# Altium schematic sheet Nuio_Left_Keyboard_Rev_H_MCU.SchDoc: Nuio - Left Keyboard MCU
size B; SheetNumber: 2; SheetTotal: 5; PageSetup: Record=PageOptions|CenterHorizontal=True|CenterVertical=True|PrintScale=0.95|XCorrection=1.00|YCorrection=1.00|PrintKind=1|BorderSize=5000000|LeftOffset=0|BottomOffset=0|Orientation=2|PaperLength=1000|PaperWidth=1000|Scale=100|PaperSource=7|PrintQuality=-4|MediaType=1|DitherType=10|PaperKind=Letter|PrintScaleMode=1
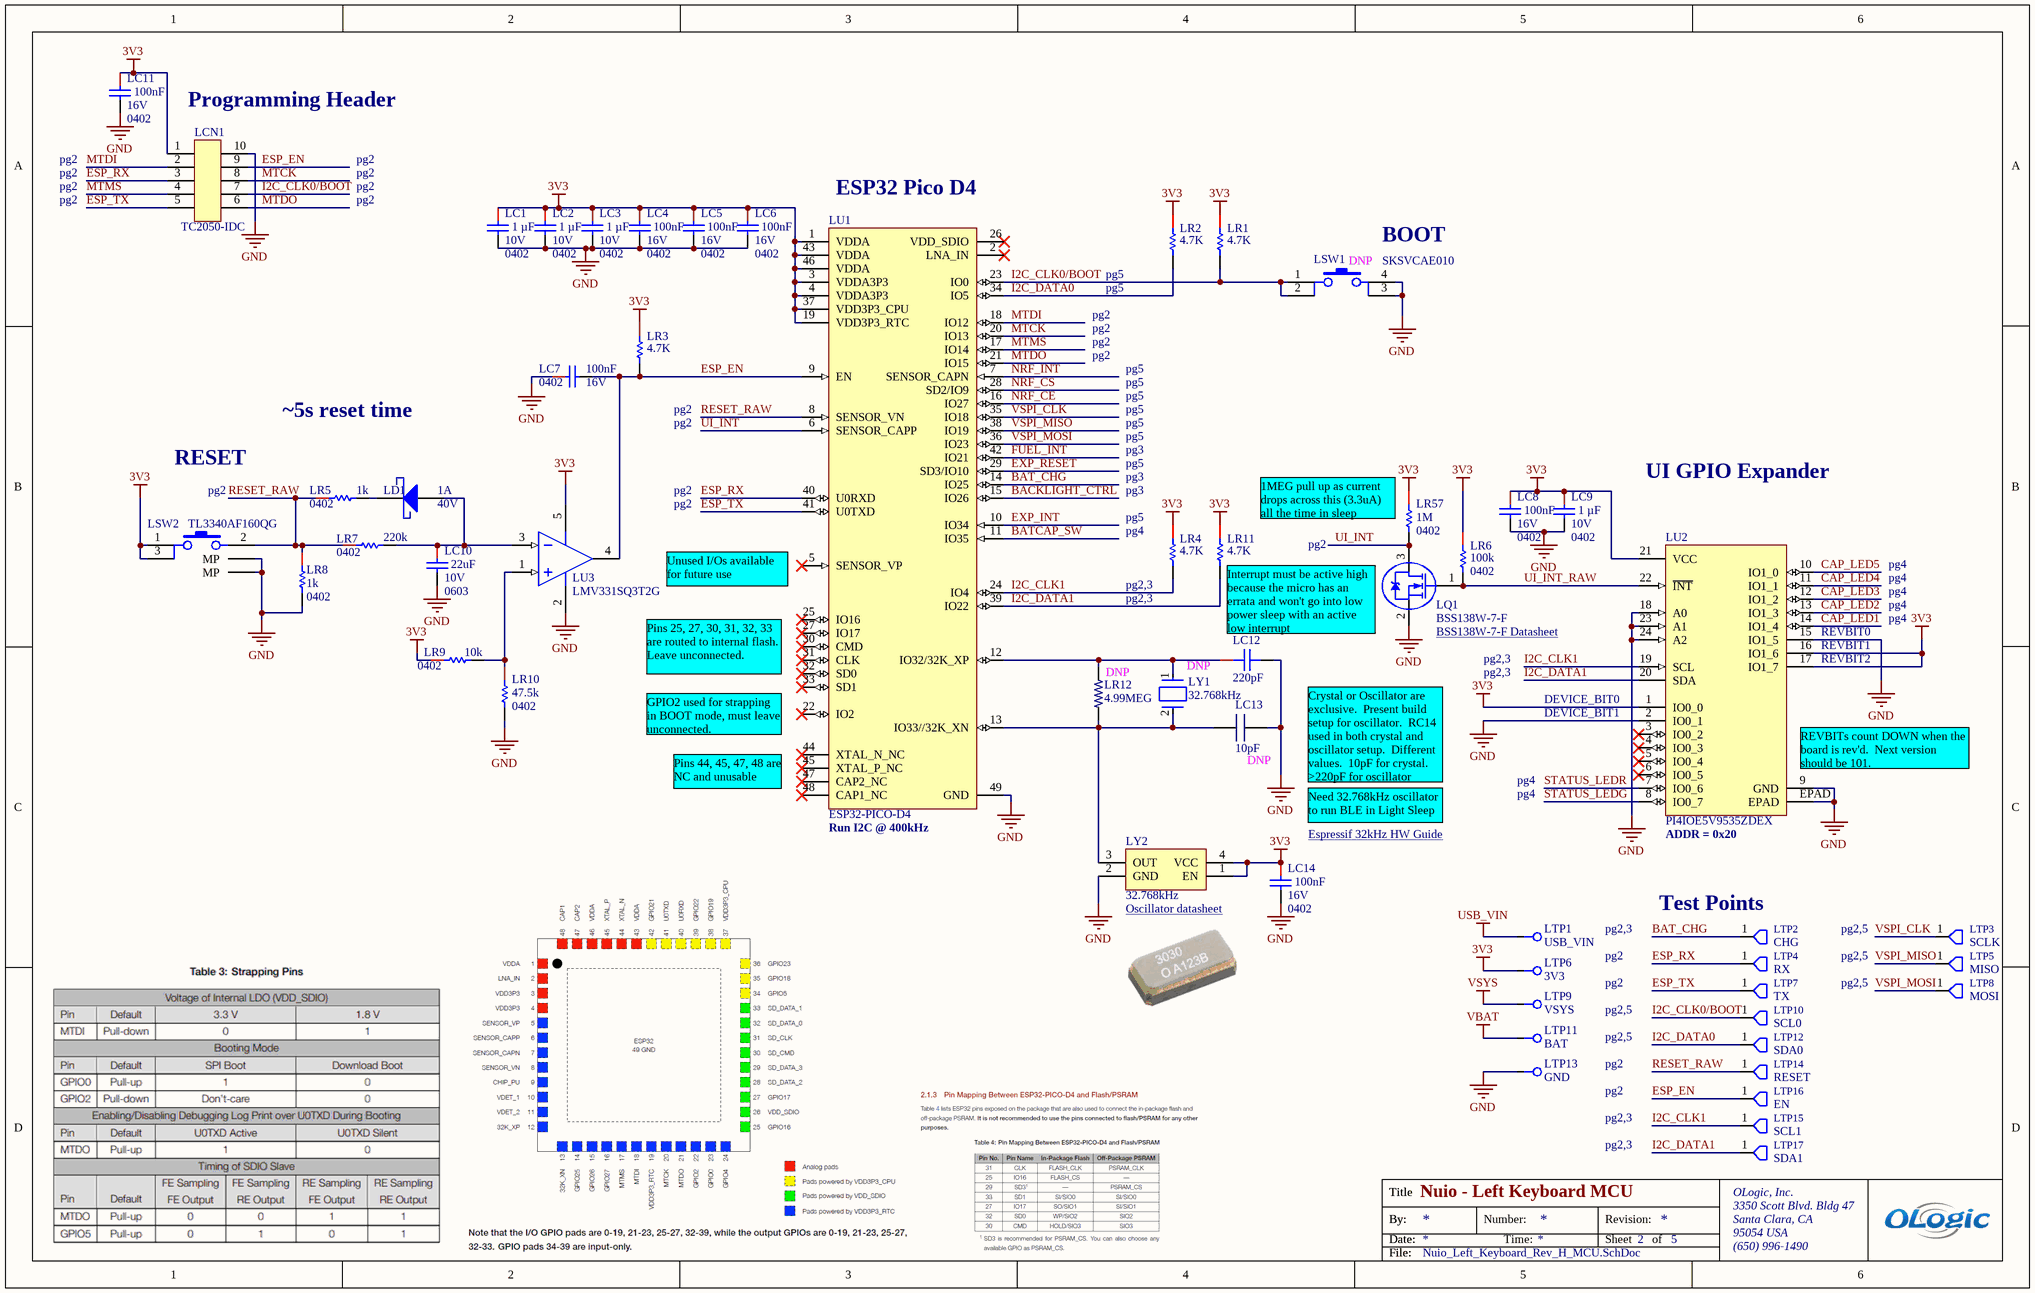
[diagram p0: Nuio_Left_Keyboard_Rev_H_MCU.SchDoc]

## Parts
LC1  Package (Imperial): 0402  Voltage (Rated): 10V  Capacitance: 1 µF  [CAPC0402(1005)_L]  (hidden comment: CAP CER 1UF 10V X5R 0402)
LC2  Package (Imperial): 0402  Voltage (Rated): 10V  Capacitance: 1 µF  [CAPC0402(1005)_L]  (hidden comment: CAP CER 1UF 10V X5R 0402)
LC3  Package (Imperial): 0402  Voltage (Rated): 10V  Capacitance: 1 µF  [CAPC0402(1005)_L]  (hidden comment: CAP CER 1UF 10V X5R 0402)
LC4  Package (Imperial): 0402  Voltage (Rated): 16V  Capacitance: 100nF  [CAPC0402(1005)_L]  (hidden comment: CAP CER 0.1UF 16V X5R 0402)
LC5  Package (Imperial): 0402  Voltage (Rated): 16V  Capacitance: 100nF  [CAPC0402(1005)_L]  (hidden comment: CAP CER 0.1UF 16V X5R 0402)
LC6  Package (Imperial): 0402  Voltage (Rated): 16V  Capacitance: 100nF  [CAPC0402(1005)_L]  (hidden comment: CAP CER 0.1UF 16V X5R 0402)
LC7  Package (Imperial): 0402  Voltage (Rated): 16V  Capacitance: 100nF  [CAPC0402(1005)_L]  (hidden comment: CAP CER 0.1UF 16V X5R 0402)
LC8  Package (Imperial): 0402  Voltage (Rated): 16V  Capacitance: 100nF  [CAPC0402(1005)_L]  (hidden comment: CAP CER 0.1UF 16V X5R 0402)
LC9  Package (Imperial): 0402  Voltage (Rated): 10V  Capacitance: 1 µF  [CAPC0402(1005)_L]  (hidden comment: CAP CER 1UF 10V X5R 0402)
LC10  22uF  Voltage Rating (DC): 10V  Case Code (Imperial): 0603  [CAPC0603(1608)_L]
LC11  Package (Imperial): 0402  Voltage (Rated): 16V  Capacitance: 100nF  [CAPC0402(1005)_L]  (hidden comment: CAP CER 0.1UF 16V X5R 0402)
LC12  220pF  [CAPC0402(1005)_L]
LC13  10pF  [CAPC0402(1005)_L]  (no BOM)
LC14  Package (Imperial): 0402  Voltage (Rated): 16V  Capacitance: 100nF  [CAPC0402(1005)_L]  (hidden comment: CAP CER 0.1UF 16V X5R 0402)
LCN1  TC2050-IDC  [TC2050-IDC]  (no BOM)
LD1  DC Reverse Voltage Max: 40V  Current Avg Rectified: 1A  [PMEG4010AESBYL-Footprint-1]  (hidden comment: PMEG4010AESBYL)
LQ1  BSS138W-7-F  [DIOD-SOT323-3_V]
LR1  4.7K  [RESC0402(1005)_L]
LR2  4.7K  [RESC0402(1005)_L]
LR3  4.7K  [RESC0402(1005)_L]
LR4  4.7K  [RESC0402(1005)_L]
LR5  Resistance: 1k  Package (Imperial): 0402  [RESC0402(1005)_L]  (hidden comment: RES SMD 1K OHM 1% 1/16W 0402)
LR6  value 100k  Case Code (Imperial): 0402  [RESC0402(1005)_L]  (hidden comment: RES 100K OHM 1% 1/16W 0402)
LR7  Package (Imperial): 0402  [RESC0402(1005)_L]  (hidden comment: 220K)
LR8  Resistance: 1k  Package (Imperial): 0402  [RESC0402(1005)_L]  (hidden comment: RES SMD 1K OHM 1% 1/16W 0402)
LR9  Resistance: 10k  Package (Imperial): 0402  [RESC0402_YAGEO]  (hidden comment: RES SMD 10K OHM 1% 1/16W 0402)
LR10  Resistance: 47.5k  Package (Imperial): 0402  [RESC0402(1005)_L]  (hidden comment: RES 47.5K OHM 1% 1/16W 0402)
LR11  4.7K  [RESC0402(1005)_L]
LR12  4.99MEG  [RESC0402(1005)_L]  (no BOM)
LR57  Resistance: 1M  Case/Package: 0402  [RESC0402(1005)_L]  (hidden comment: RES 1M OHM 1% 1/16W 0402)
LSW1  SKSVCAE010  [SKSVCAE010]  (no BOM)
LSW2  TL3340AF160QG  [TL3340AF160QG]
LTP1  USB_VIN  [Pogo-Testpoint]  (no BOM)
LTP2  CHG  [MTK-TESTPOINT-20]  (no BOM)
LTP3  SCLK  [MTK-TESTPOINT-20]  (no BOM)
LTP4  RX  [MTK-TESTPOINT-20]  (no BOM)
LTP5  MISO  [MTK-TESTPOINT-20]  (no BOM)
LTP6  3V3  [Pogo-Testpoint]  (no BOM)
LTP7  TX  [MTK-TESTPOINT-20]  (no BOM)
LTP8  MOSI  [MTK-TESTPOINT-20]  (no BOM)
LTP9  VSYS  [Pogo-Testpoint]  (no BOM)
LTP10  SCL0  [MTK-TESTPOINT-20]  (no BOM)
LTP11  BAT  [Pogo-Testpoint]  (no BOM)
LTP12  SDA0  [MTK-TESTPOINT-20]  (no BOM)
LTP13  GND  [Pogo-Testpoint]  (no BOM)
LTP14  RESET  [MTK-TESTPOINT-20]  (no BOM)
LTP15  SCL1  [MTK-TESTPOINT-20]  (no BOM)
LTP16  EN  [MTK-TESTPOINT-20]  (no BOM)
LTP17  SDA1  [MTK-TESTPOINT-20]  (no BOM)
LU1  ESP32-PICO-D4  [ESP32-PICO-D4]
LU2  PI4IOE5V9535ZDEX  [PI4IOE5V9535ZDEX]
LU3  LMV331SQ3T2G  [ONSC-SC70-5-419A-02_K_L]
LY1  32.768kHz  [FP-9HT10-MFG]  (no BOM)
LY2  32.768kHz  [ESPSON SG-3031CM]

## Nets
3V3: LC1.1 LC2.1 LC3.1 LC4.1 LC5.1 LC6.1 LC8.1 LC9.1 LC11.1 LC14.1 LCN1.1 LR1.1 LR2.1 LR3.1 LR4.1 LR6.1 LR9.1 LR11.1 LR57.1 LSW2.1 LSW2.3 LTP6.1 LU1.1(VDDA) LU1.3(VDDA3P3) LU1.4(VDDA3P3) LU1.19(VDD3P3_RTC) LU1.37(VDD3P3_CPU) LU1.43(VDDA) LU1.46(VDDA) LU2.1(IO0_0) LU2.16(IO1_6) LU2.17(IO1_7) LU2.21(VCC) LU3.5(VCC) LY2.1(EN) LY2.4(VCC)
GND: LC1.2 LC2.2 LC3.2 LC4.2 LC5.2 LC6.2 LC7.1 LC8.2 LC9.2 LC10.2 LC11.2 LC12.2 LC13.2 LC14.2 LCN1.10 LQ1.2(S) LR8.2 LR10.2 LSW1.3 LSW1.4 LSW2.MP1(MP) LSW2.MP2(MP) LTP13.1 LU1.49(GND) LU2.2(IO0_1) LU2.9(GND) LU2.15(IO1_5) LU2.18(A0) LU2.23(A1) LU2.24(A2) LU2.EPAD LU3.2(GND) LY2.2(GND)
USB_VIN: LTP1.1
VBAT: LTP11.1
VSYS: LTP9.1
BACKLIGHT_CTRL: LU1.15(IO26)
BAT_CHG: LTP2.1(TP) LU1.14(IO25)
BATCAP_SW: LU1.11(IO35)
CAP_LED1: LU2.14(IO1_4)
CAP_LED2: LU2.13(IO1_3)
CAP_LED3: LU2.12(IO1_2)
CAP_LED4: LU2.11(IO1_1)
CAP_LED5: LU2.10(IO1_0)
ESP_EN: LC7.2 LCN1.9 LR3.2 LTP16.1(TP) LU1.9(EN) LU3.4(OUT)
ESP_RX: LCN1.3 LTP4.1(TP) LU1.40(U0RXD)
ESP_TX: LCN1.5 LTP7.1(TP) LU1.41(U0TXD)
EXP_INT: LU1.10(IO34)
EXP_RESET: LU1.29(SD3/IO10)
FUEL_INT: LU1.42(IO21)
I2C_CLK0/BOOT: LCN1.7 LR1.2 LSW1.1 LSW1.2 LTP10.1(TP) LU1.23(IO0)
I2C_CLK1: LR4.2 LTP15.1(TP) LU1.24(IO4) LU2.19(SCL)
I2C_DATA0: LR2.2 LTP12.1(TP) LU1.34(IO5)
I2C_DATA1: LR11.2 LTP17.1(TP) LU1.39(IO22) LU2.20(SDA)
MTCK: LCN1.8 LU1.20(IO13)
MTDI: LCN1.2 LU1.18(IO12)
MTDO: LCN1.6 LU1.21(IO15)
MTMS: LCN1.4 LU1.17(IO14)
NRF_CE: LU1.16(IO27)
NRF_CS: LU1.28(SD2/IO9)
NRF_INT: LU1.7(SENSOR_CAPN)
RESET_RAW: LR5.1 LR7.1 LR8.1 LSW2.2 LTP14.1(TP) LU1.8(SENSOR_VN)
STATUS_LEDG: LU2.8(IO0_7)
STATUS_LEDR: LU2.7(IO0_6)
UI_INT: LQ1.3(D) LR57.2 LU1.6(SENSOR_CAPP)
UI_INT_RAW: LQ1.1(G) LR6.2 LU2.22(~{INT})
VSPI_CLK: LTP3.1(TP) LU1.35(IO18)
VSPI_MISO: LTP5.1(TP) LU1.38(IO19)
VSPI_MOSI: LTP8.1(TP) LU1.36(IO23)
NetLC10_1: LC10.1 LD1.2(A) LR7.2 LU3.3(IN-)
NetLC12_1: LC12.1 LR12.2 LU1.12(IO32/32K_XP) LY1.1
NetLC13_1: LC13.1 LR12.1 LU1.13(IO33//32K_XN) LY1.2 LY2.3(OUT)
NetLD1_1: LD1.1(K) LR5.2
NetLR9_2: LR9.2 LR10.1 LU3.1(IN+)

Not connected (* = marked no-connect by the designer): LU1 2(LNA_IN)* 5(SENSOR_VP)* 22(IO2)* 25(IO16)* 26(VDD_SDIO)* 27(IO17)* 30(CMD)* 31(CLK)* 32(SD0)* 33(SD1)* 44(XTAL_N_NC)* 45(XTAL_P_NC)* 47(CAP2_NC)* 48(CAP1_NC)*; LU2 3(IO0_2)* 4(IO0_3)* 5(IO0_4)* 6(IO0_5)*

## Notes on the sheet
- pg2
- (near LCN1) Programming Header
- (near LU1) ESP32 Pico D4
- (near LR2) pg5
- pg5
- (near LSW1) DNP
- (near LSW1) BOOT
- ~5s reset time
- (near LR3) pg2
- RESET
- (near LSW2) pg2
- pg3
- (near LR4) pg3
- UI GPIO Expander
- (near LR4) pg5
- (near LR4) pg4
- (near LR57) 1MEG pull up as current drops across this (3.3uA) all the time in sleep
- pg4
- (near LU1) Unused I/Os available for future use
- (near LR4) pg2,3
- (near LR11) Interrupt must be active high because the micro has an errata and won't go into low power sleep with an active low interrupt
- (near LQ1) BSS138W-7-F Datasheet <https://docs.espressif.com/projects/esp-hardware-design-guidelines/en/latest/esp32/schematic-checklist.html>
- (near LU2) REVBIT0
- Pins 25, 27, 30, 31, 32, 33 are routed to internal flash.  Leave unconnected.
- (near LR12) DNP
- (near LY1) DNP
- pg2,3
- DEVICE_BIT0
- (near LU2) REVBIT1
- (near LU2) REVBIT2
- (near LU1) GPIO2 used for strapping in BOOT mode, must leave unconnected.
- (near LC13) DNP
- Crystal or Oscillator are exclusive.  Present build setup for oscillator.  RC14 used in both crystal and oscillator setup.  Different values.  10pF for crystal.  >220pF for oscillator
- DEVICE_BIT1
- (near LU2) REVBITs count DOWN when the board is rev'd.  Next version should be 101.
- (near LU1) Pins 44, 45, 47, 48 are NC and unusable
- (near LU1) Run I2C @ 400kHz
- Need 32.768kHz oscillator to run BLE in Light Sleep
- (near LC14) Espressif 32kHz HW Guide <https://docs.espressif.com/projects/esp-hardware-design-guidelines/en/latest/esp32/schematic-checklist.html>
- (near LU2) ADDR = 0x20
- Oscillator datasheet <https://support.epson.biz/td/api/doc_check.php?dl=brief_SG-3031CM&lang=en>
- (near LTP2) Test Points
- pg2,5
- Title
- By:
- Date:
- Number:
- Time:
- Revision:
- Sheet
- of
- OLogic, Inc.
- 3350 Scott Blvd. Bldg 47
- Santa Clara, CA
- 95054 USA
- File:
- (650) 996-1490

## Library data of the parts
LC1-LC3 LC9 = CMP-001-1453-04: ±20% 10V Ceramic Capacitor X5R 0402 (1005 Metric); Manufacturer Part Number: CC0402MRX5R6BB105; Manufacturer: Yageo; Supplier: Digi-Key; Tolerance: ±20%; Supplier Part Number: 311-1732-1-ND; Temperature Coefficient: X5R; Height: 0.55mm
LC4-LC8 LC11 LC14 = CMP-001-0605-23: ±10% 16V Ceramic Capacitor X5R 0402 (1005 Metric); Manufacturer: Taiyo Yuden; Manufacturer Part Number: EMK105BJ104KV-F; Package (Metric): 1005; Temperature (Max): 85°C; Temperature (Min): -55°C; Height: 550µm; Supplier: Digi-Key; Supplier Part Number: 587-1226-1-ND; Tolerance: 10%; Dielectric Material: Ceramic; Temperature Coefficient: X5R; Width: 500µm; Length: 1mm; Mounting Type: SMD
LC10 = CMP-001-0737-03: CAP CER 22UF 10V 20% 0603; Dielectric: X5R; Max Operating Temperature: 85°C; Termination: SMD/SMT; Case Code (Metric): 1608; Width: 0.8mm; Length: 1.6mm; Packaging: Tape and Reel; Capacitance: 22uF; Tolerance: 20%; Mount: Surface Mount; Weight: 0.000222oz; Package Quantity: 4000; Min Operating Temperature: -55°C; Lead Free: Lead Free; REACH SVHC: No SVHC; Thickness: 0.039inch; Depth: 0.8mm; Voltage Rating: 10V; Material: Ceramic; Height: 0.8mm; Case/Package: 0603
LC12 = 220pF: 220pF 25V 0402 Capacitor; Manufacturer 1: Cal-Chip Electronics; Manufacturer Part Number 1: GMC04CG221J25NT; Supplier 1: DigiKey; RoHS: Yes; Stock 1: 10000; Pricing 1: 1=0.1, 10=0.021, 50=0.0144, 100=0.0122, 500=0.00852, 1000=0.00739, 2500=0.0062, 5000=0.00549 (USD); RoHS Compliant: Yes; Supplier Part Number 1: 4713-GMC04CG221J25NTCT-ND
LC13 = 10pF 16V 0402 Capacitor: Manufacturer 1: Kemet; Manufacturer Part Number 1: C0402C100K4GACTU; Tolerance: ±10%; Temperature Coefficient: C0G, NP0; Supplier 1: Digi-Key; RoHS: RoHS Compliant; Category: Capacitors; Stock 1: 20000; Pricing 1: 10000=0.0525, 20000=0.0498, 30000=0.048, 50000=0.045, 100000=0.03975 (USD); Packaging: Tape & Reel (TR); Capacitance: 10pF; Voltage - Rated: 16V; Mounting Type: Surface Mount, MLCC; Operating Temperature: -55°C ~ 125°C; Applications: General Purpose; Ratings: -; Package / Case: 0402 (1005 Metric); Size / Dimension: 0.039" L x 0.020" W (1.00mm x 0.50mm); Height - Seated (Max): -; Thickness (Max): 0.022" (0.55mm); Lead Spacing: -; Features: -; Lead Style: -; ComponentLink1URL: http://www.kemet.com/datasheets&C0402C100K4GACTU; ComponentLink1Description: http://www.kemet.com/datasheets&C0402C100K4GACTU; Supplier Part Number 1: 399-11110-2-ND
LCN1 = CMP-001-1753-01: Adapter Cbl Plug Of Nails 10PIN; Package Quantity: 1; Series: Plug-Of-Nails™; RoHS Compliant: Yes
LD1 = CMP-001-0106-06: DIODE SCHOTTKY 40V 1A SOD993; Voltage Forward Max: 505mV @ 1A; Diode Type: Schottky
LQ1 = CMP-00300-01: DIODES INC. - BSS138W-7-F. - BSS FAMILY SOT323 T&R 3K ROHS COMPLIANT: YES; Manufacturer 1: Diodes Incorporated; Voltage: 50V; Power: 200mW; Current Rating: 200mA; Number of Channels: 1; Drain to Source Breakdown Voltage: 75V; Element Configuration: Single; Turn-On Delay Time: 20ns; Gate to Source Voltage (Vgs): 20V; Threshold Voltage: 1.2V; Input Capacitance: 50pF; On-State Resistance: 3.5R; Polarity: N-CHANNEL; Drain to Source Resistance: 1.4R; Drain to Source Voltage (Vdss): 50V; Number of Elements: 1; Lead Free: Lead Free; Min Operating Temperature: -55°C; Max Operating Temperature: 150°C; Nominal Vgs: 1.2V; Packaging: Tape and Reel; Drain-source On Resistance-Max: 3.5R; Width: 1.35mm; Termination: SMD/SMT; Rds On Max: 3.5R; Height: 1mm; REACH SVHC: No SVHC; Package Quantity: 3000; Case/Package: SOT-323; Contact Plating: Tin,Matte; RoHS Compliant: Yes; Length: 2.2mm; Number of Pins: 3; Mount: Surface Mount; Weight: 0.000212oz; Turn-Off Delay Time: 20ns; Series: -; Dual Supply Voltage: 50V; Max Power Dissipation: 200mW; Manufacturer Part Number 1: BSS138W-7-F; Continuous Drain Current (ID): 200mA; Supplier 1: Digi Key; Supplier Part Number 1: BSS138W-FDICT-ND
LR1-LR4 LR11 = CMP-001-0724-07: SMD Chip Resistor, 4.7 kOhm, ± 1%, 62.5 mW, 0402 [1005 Metric], Thick Film, General Purpose; Manufacturer 1: Yageo; Manufacturer Part Number 1: RC0402FR-074K7L; Max Power Dissipation: 63mW; Power Rating: 62.5mW; Value: 4.7kR; Temperature Coefficient: 100ppm/°C; Voltage Rating: 50V; Min Operating Temperature: -55°C; Termination: SMD/SMT; Max Operating Temperature: 155°C; Width: 0.5mm; Length: 1mm; Tolerance: 1%; Case Code (Imperial): 0402; Case/Package: 0402; Construction: Rectangular; Depth: 0.5mm; Features: Moisture Resistant; Lead Free: Lead Free; Military Standard: Not; Reach SVHC Compliant: No; Resistance Tolerance: 1%; Resistor Type: Thick Film; RoHS Compliant: Yes; Series: RC; Voltage Rating (DC): 50V; Supplier 1: Digikey; RoHS: Yes; Category: Chip SMD Resistors; Stock 1: 6013334; Pricing 1: 1=0.1, 10=0.015, 50=0.0088, 100=0.0073, 500=0.00488, 1000=0.00417, 5000=0.00297 (USD); Pins: 2; Case Code (Metric): 1005; Packaging: Tape and Reel; Number of Terminations: 2; ComponentLink1URL: https://datasheet.ciiva.com/15215/getdatasheetpartid-328119-15215035.pdf?src-supplier=Verical; ComponentLink1Description: https://datasheet.ciiva.com/15215/getdatasheetpartid-328119-15215035.pdf?src-supplier=Verical; ComponentLink2URL: https://datasheet.ciiva.com/7850/1018594-7850022.pdf?src-supplier=Element14; ComponentLink2Description: https://datasheet.ciiva.com/7850/1018594-7850022.pdf?src-supplier=Element14; ComponentLink3URL: https://datasheet.ciiva.com/7850/1018594-7850023.pdf?src-supplier=Element14; ComponentLink3Description: https://datasheet.ciiva.com/7850/1018594-7850023.pdf?src-supplier=Element14; ComponentLink4URL: https://datasheet.ciiva.com/22661/1686128-22661342.pdf?src-supplier=Element14; ComponentLink4Description: https://datasheet.ciiva.com/22661/1686128-22661342.pdf?src-supplier=Element14; Supplier Part Number 1: 311-4.7KLRCT-ND
LR5 LR8 = CMP-007-0405-16: 1k ±1% 0.063W, 1/16W Chip Resistor 0402 (1005 Metric) Moisture Resistant Thick FilmRES 1K OHM 1% 1/16W 0402; Manufacturer: Yageo; Manufacturer Part Number: RC0402FR-071KL; Power: 63mW; Package (Metric): 1005; Temperature Coefficient: 100ppm/°C; Supplier Part Number: 311-1.00KLRCT-ND; Supplier: Digi-Key; Height: 400µm; Termination: SMD/SMT; Composition: Thick Film; Width: 500µm; Tolerance: 1%
LR6 = CMP-007-0354-15: ±1% 0.063W, 1/16W Chip Resistor 0402 (1005 Metric) Moisture Resistant Thick Film; Manufacturer: YAGEO; Manufacturer Part Number: RC0402FR-07100KL; Max Power Dissipation: 63mW; Temperature Coefficient: 100ppm/°C; Voltage Rating: 50V; Case/Package: 0402; Construction: Rectangular; Depth: 0.5mm; Features: Moisture Resistant; Height: 0.016inch; Lead Free: Lead Free; Length: 0.039inch; Max Operating Temperature: 155°C; Military Standard: Not; Min Operating Temperature: -55°C; Power Rating: 63mW; Reach SVHC Compliant: No; Resistance Tolerance: 1%; Resistor Type: Thick Film; RoHS Compliant: Yes; Series: RC; Termination: SMD/SMT; Tolerance: 1%; Width: 0.02inch
LR7 = CMP-00007-24: RES SMD 220K OHM 1% 1/10W 0402; Package (Metric): 1005; Max Power Dissipation: 100mW; Temperature Coefficient: 100ppm/°C; Voltage Rating: 50V; Power: 63mW; Lead Free: Lead Free; Termination: SMD/SMT; Resistance: 220k; Min Operating Temperature: -55°C; Features: Automotive AEC-Q200; Contact Plating: Tin; Width: 500µm; Package Quantity: 1; Mount: Surface Mount; Max Operating Temperature: 155°C; Tolerance: 1%; Composition: Thick Film; Power Rating: 100mW; Weight: 2.8E-05oz; REACH SVHC: No SVHC; Depth: 0.5mm; Radiation Hardening: No; Packaging: Tape and Reel; Voltage Rating (DC): 50V; Length: 1mm; Number of Terminations: 2; Height: 350µm; Military Standard: Not
LR9 = CMP-001-1262-04: 10 kOhms ±1% 0.063W, 1/16W Chip Resistor 0402 (1005 Metric) Anti-Sulfur, Automotive AEC-Q200, Moisture Resistant Thin Film; Manufacturer: Yageo; Manufacturer Part Number: AT0402FRE0710KL; Max Power Dissipation: 63mW; Temperature Coefficient: 50ppm/°C; Width: 0.02inch; Case Code (Metric): 1005; Height: 0.014inch; Min Operating Temperature: -55°C; Supplier: Digi-Key; Tolerance: 1%; Features: Moisture Resistant,Automotive AEC-Q200,Anti-Sulfur; Length: 0.039inch; Number of Terminations: 2; Case/Package: 0402; Packaging: Tape and Reel; Composition: Thin Film; Supplier Part Number: YAG2104CT-ND; Max Operating Temperature: 155°C
LR10 = CMP-001-1735-03: 47.5 kOhms ±1% 0.063W, 1/16W Chip Resistor 0402 (1005 Metric) Moisture Resistant Thick Film; Manufacturer: Panasonic Electronic Components; Manufacturer Part Number: ERA-2ARB6041X; Temperature Coefficient: 100ppm/°C; Max Power Dissipation: 63mW; Power Rating: 62.5mW; Voltage Rating: 50V; Case Code (Metric): 1005; Min Operating Temperature: -55°C; Resistance Tolerance: 1%; Width: 0.02inch; REACH SVHC: No SVHC; Case/Package: 0402; Size Code: 0402; Depth: 0.5mm; Series: RC; Number of Terminations: 2; Packaging: Tape and Reel; Termination: SMD/SMT; Case Code (Imperial): 0402; Resistor Type: Thick Film; Tolerance: 1%; Height: 0.016inch; Construction: Rectangular; Lead Free: Lead Free; Features: Moisture Resistant; Length: 1mm; Military Standard: Not; Voltage Rating (DC): 50V; Max Operating Temperature: 155°C; RoHS Compliant: Yes; Composition: Thin Film
LR12 = 4.99MEG 0402 Resistor 1%: Manufacturer: Vishay Dale; Manufacturer Part Number: CRCW04024M99FKEDC; Value: 4.99MR; Max Power Dissipation: 63mW; Temperature Coefficient: 100ppm/°C; Supplier 1: Digikey; RoHS: Yes; Category: Chip SMD Resistors; Stock 1: 96023; Pricing 1: 1=0.1, 10=0.024, 50=0.0152, 100=0.0127, 500=0.00866, 1000=0.00746, 5000=0.00542 (USD); Case/Package: 0402; Case Code (Imperial): 0402; Case Code (Metric): 1005; Min Operating Temperature: -55°C; Max Operating Temperature: 155°C; Packaging: Cut Tape; Tolerance: 1%; Number of Terminations: 2; Series: CRCW-C; RoHS Compliant: Yes; ComponentLink1URL: http://www.vishay.com/docs/28773/crcwce3.pdf?src-supplier=Digikey; ComponentLink1Description: http://www.vishay.com/docs/28773/crcwce3.pdf?src-supplier=Digikey; ComponentLink2URL: https://datasheet.octopart.com/CRCW04024M99FKEDC-Vishay-datasheet-102570912.pdf?src-supplier=Future+Electronics; ComponentLink2Description: https://datasheet.octopart.com/CRCW04024M99FKEDC-Vishay-datasheet-102570912.pdf?src-supplier=Future+Electronics; Supplier Part Number 1: 541-4110-1-ND
LR57 = CMP-001-1995-03: 1 MOhms ±1% 0.063W, 1/16W Chip Resistor 0402 (1005 Metric) Moisture Resistant Thick Film; Manufacturer: YAGEO; Manufacturer Part Number: RC0402FR-071ML; Power Rating: 63mW; Voltage Rating: 50V; Temperature Coefficient: 100ppm/°C; Termination: SMD/SMT; Technology: THICK FILM; Features: Moisture Resistant; Depth: 0.5mm; RoHS Compliant: Yes; Military Standard: Not; Series: RC; Construction: Rectangular; Resistance Tolerance: 1%; Size Code: 0402; Length: 1mm; Resistor Type: Thick Film; Min Operating Temperature: -55°C; Max Power Dissipation: 63mW; Height: 0.32mm; Lead Free: Lead Free; Max Operating Temperature: 155°C; Tolerance: 1%; REACH SVHC: Unknown
LSW1 = CMP-00343-02: 2.8x1.9mm Compact Type with Projection Surface Mount SKSV Series Tact Switch; Manufacturer: Alps Alpine; Voltage Rating (DC): 12 VDC; Current Rating: 50 mA; Manufacturer Part Number: SKSVCAE010; RoHS Compliant: Yes
LSW2 = CMP-00359-04: SWITCH TACTILE SPST-NO 0.05A 12V; Current Rating: 50mA; Operating Force: 160gf; Actuator Length: 0.85mm; Electrical Life: 100000Cycles; Switch Travel: 0.2mm; Switch Function: Off-Mom; Actuator Type: Standard; Actuator Material: Polyphthalamide; Max Operating Temperature: 85°C; Min Operating Temperature: -35°C; Packaging: Tape and Reel; Mechanical Life: 100000Cycles; Contact Plating: Stainless Steel,Silver; Package Quantity: 1; Series: TL3340; Contact Material: Stainless Steel,Silver; Mount: Surface Mount
LTP1 LTP6 LTP9 LTP11 LTP13 = CMP-001-0557-04: Test Point- Current one
LTP2-LTP5 LTP7 LTP8 LTP10 LTP12 LTP14-LTP17 = CMP-001-1043-02: MTK-TP20MIL
LU1 = CMP-001-1982-03: SoC RF SIP Module Dual Core MCU 2, 4GHz; Manufacturer 1: Espressif Systems; Operating Supply Voltage: 3.6V; Data Bus Width: 32b; Interface: I2C,SPI,I2S,UART; RAM Size: 520KB; Memory Size: 4MB; Number of ADC Channels: 10; Output Power (dBm): 20dBm; Data Rate: 150Mbps; Operating Frequency: 2.4 GHz to 2.5 GHz; Sensitivity: -97dBm; Memory Format: FLASH; Clock Frequency: 40MHz; Bandwidth: 72MHz; Min Supply Voltage: 2.7V; Nominal Supply Current: 80mA; Number of GPIO: 22; Series: ESP32; Case/Package: QFN; Height: 0.94mm; Package Quantity: 2000; Width: 7mm; Min Operating Temperature: -40°C; Max Operating Temperature: 85°C; Length: 7mm; Supplier 1: Digikey; Manufacturer Part Number 1: ESP32-PICO-D4; RoHS: No; Category: RF Receivers, Transceivers; Stock 1: 3196; Pricing 1: 1=4.5 (USD); Max Supply Voltage: 3.6V; ComponentLink1URL: https://www.espressif.com/sites/default/files/documentation/esp32-pico-d4_datasheet_en.pdf?src-supplier=Digikey; ComponentLink1Description: https://www.espressif.com/sites/default/files/documentation/esp32-pico-d4_datasheet_en.pdf?src-supplier=Digikey; ComponentLink2URL: https://datasheet.octopart.com/ESP32-PICO-D4-Espressif-Systems-datasheet-165560559.pdf?src-supplier=TME; ComponentLink2Description: https://datasheet.octopart.com/ESP32-PICO-D4-Espressif-Systems-datasheet-165560559.pdf?src-supplier=TME; Supplier Part Number 1: 1904-1029-1-ND
LU2 = CMP-001-2127-03: IC I/o Expander 16B I2C 24TQFN; Manufacturer 1: Diodes; Frequency: 400kHz; Number of I/Os: 16; RoHS Compliant: Yes; Min Operating Temperature: -40°C; Mounting Technology: Surface Mount; Series: -; Packaging: Cut Tape; Interface: I2C; Max Operating Temperature: 85°C; Supplier 1: Digikey; Manufacturer Part Number 1: PI4IOE5V9535ZDEX; RoHS: Yes; Stock 1: 53776; Pricing 1: 1=1.55, 10=1.392, 25=1.3128, 100=1.1187, 250=1.0504, 500=0.9191, 1000=0.76154 (USD); ComponentLink1URL: https://media.digikey.com/pdf/Data%20Sheets/Diodes%20PDFs/PI4IOE5V9539.pdf?src-supplier=Digikey; ComponentLink1Description: https://media.digikey.com/pdf/Data%20Sheets/Diodes%20PDFs/PI4IOE5V9539.pdf?src-supplier=Digikey; ComponentLink2URL: https://datasheet.octopart.com/PI4IOE5V9535ZDEX-Diodes-Inc.-datasheet-160666369.pdf?src-supplier=SHENGYU+ELECTRONICS; ComponentLink2Description: https://datasheet.octopart.com/PI4IOE5V9535ZDEX-Diodes-Inc.-datasheet-160666369.pdf?src-supplier=SHENGYU+ELECTRONICS; Supplier Part Number 1: PI4IOE5V9535ZDEXDICT-ND
LU3 = CMP-001-2183-02: LMV Series 5 V 1 nA SMT Single General Purpose, Low Voltage Comparator - SC-70; Manufacturer: onsemi; Natural Thermal Resistance: 280°C/W; Output Current: 84mA; Voltage Gain: 93.98dB; Number of Channels: 1; Operating Supply Voltage: 3V; Propagation Delay: 1.5us; Min Supply Voltage: 2.7V; Supply Current: 120uA; Max Input Current: 1nA; Max Supply Voltage: 5V; Input Offset Voltage (Vos): 9mV; Quiescent Current: 150uA; Radiation Hardening: No; Type: General Purpose; Lead Free: Lead Free; Case/Package: SC; Min Operating Temperature: -40°C; Reach SVHC Compliant: No; Number of Elements: 1; Width: 1.35mm; Halogen Free: Halogen Free; Technology: CMOS; Package Quantity: 3000; Series: -; Pins: 5; Max Supply Current: 120uA; Length: 2.2mm; RoHS Compliant: Yes; Packaging: Tape and Reel; Height: 1mm; Input Bias Current: 1nA; Manufacturer Part Number: LMV331SQ3T2G; Max Operating Temperature: 85°C
LY1 = CMP-18717-000021-2: CRYSTAL 32.7680KHZ 6PF SMD; Frequency Tolerance: 30ppm; ESR (Equivalent Series Resistance): 70kR; Case/Package: SMD/SMT; Min Operating Temperature: -40°C; Packaging: Tape and Reel; Frequency: 32.768kHz; Width: 0.061inch; Load Capacitance: 6pF; Length: 0.126inch; Height: 0.033inch; Max Operating Temperature: 85°C; Mount: Surface Mount; Supplier 1: Digi Key; Supplier Part Number 1: 887-2600-1-ND
LY2 = OSCILLATOR SG-3031CM 32.7680KB0: Crystal Oscillator, Surface Mount Type; Manufacturer 1: Epson; RoHS: Yes; Stock 1: 2026; Pricing 1: 1=1.75, 10=1.672, 50=1.6332, 100=1.3999, 500=1.36098 (USD); RoHS Compliant: Yes; ComponentLink1URL: https://datasheet.octopart.com/SG-3031CM-32.7680KB0-Epson-datasheet-149136028.pdf?src-supplier=Future+Electronics; ComponentLink1Description: https://datasheet.octopart.com/SG-3031CM-32.7680KB0-Epson-datasheet-149136028.pdf?src-supplier=Future+Electronics; Supplier 1: Digikey; Manufacturer Part Number 1: SG-3031CM32.7680KB0; Supplier Part Number 1: 114-SG-3031CM32.7680KB0CT-ND